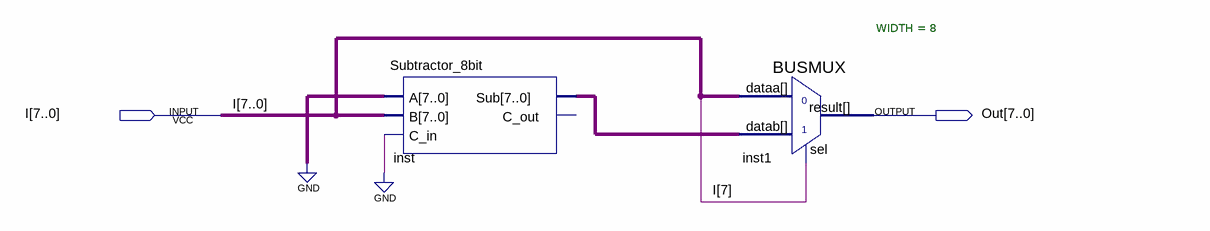
[diagram p0: schematic sheet]
// Quartus schematic Absolute_8bit.bdf as structural Verilog: 2 symbols, 2 pins
module Absolute_8bit (
  input  [7:0] I,
  output [7:0] Out
);

  wire [7:0] inst_sub;

  Subtractor_8bit inst (.A({8{1'b0}}), .B(I), .C_in(1'b0), .Sub(inst_sub));  // open: C_out
  BUSMUX #(.WIDTH(8)) inst1 (.datab(inst_sub), .sel(I[7]), .dataa(I), .result(Out));
endmodule
